# Altium schematic sheet control_module.SchDoc
size A4
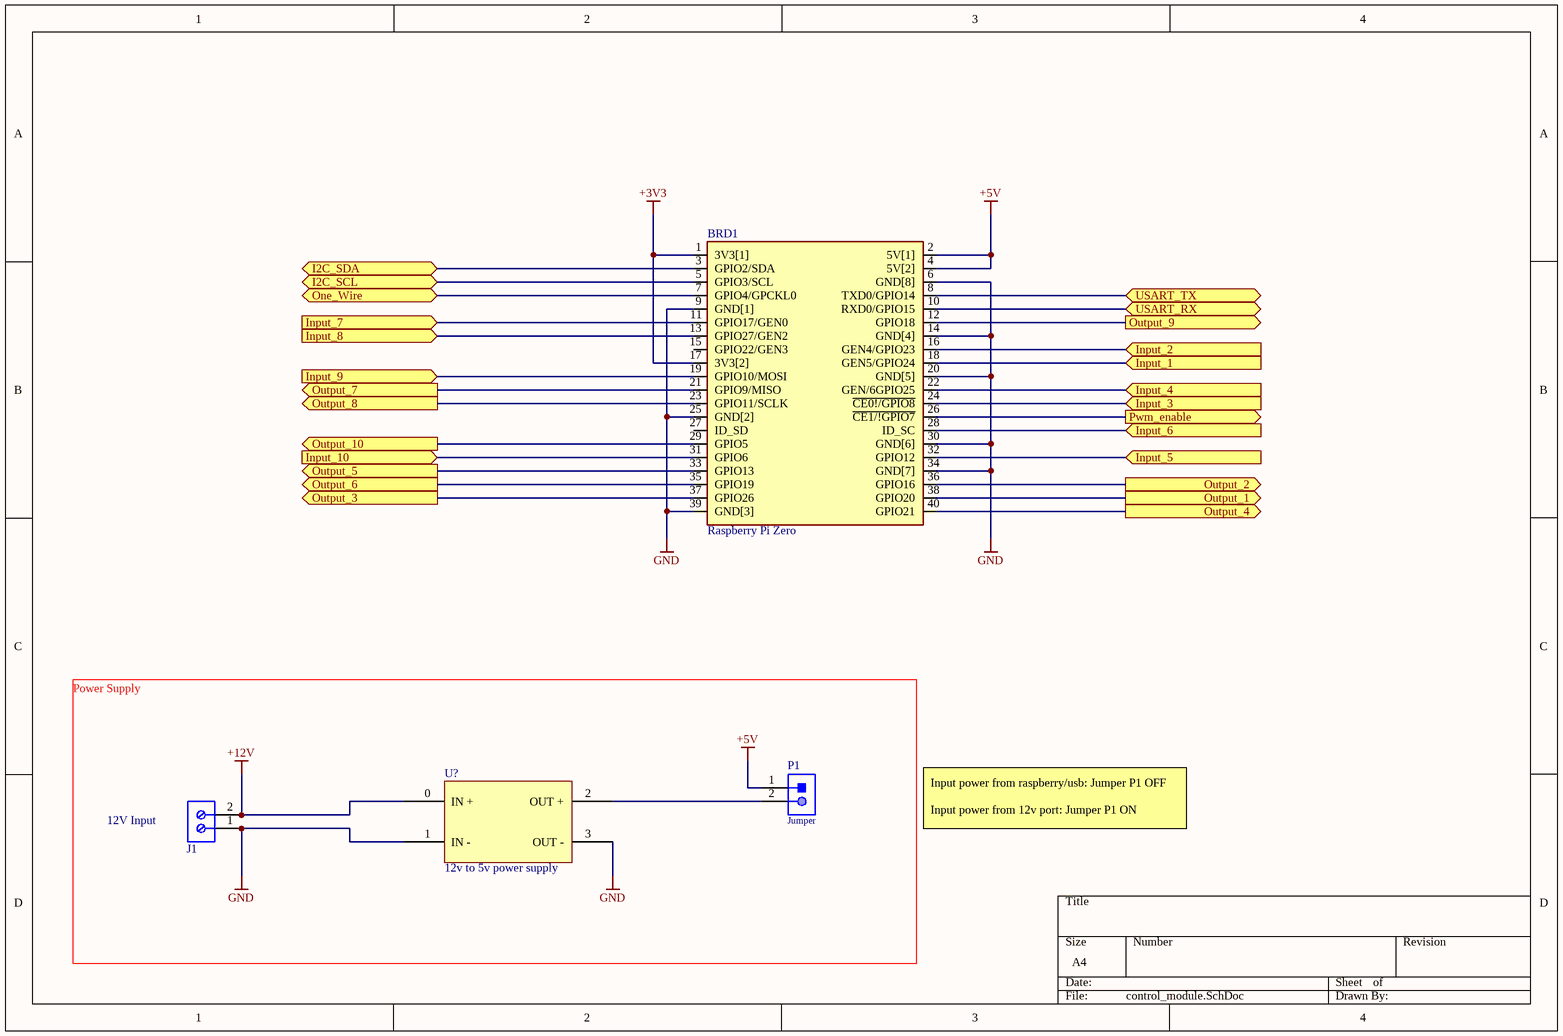
[diagram p0: control_module.SchDoc]

## Parts
BRD1  Raspberry Pi Zero  [RASPBERRY_PI_ZERO]
J1  282836-2  [TECO-282836-2_V]  (value not drawn)
P1  Jumper  [61300211121]
U?  12v to 5v power supply

## Ports
I2C_SCL (bidir), I2C_SDA (bidir), Input_1 (in), Input_2 (in), Input_3 (in), Input_4 (in), Input_5 (in), Input_6 (in), Input_7 (in), Input_8 (in), Input_9 (in), Input_10 (in), One_Wire (bidir), Output_1 (out), Output_2 (out), Output_3 (out), Output_4 (out), Output_5 (out), Output_6 (out), Output_7 (out), Output_8 (out), Output_9 (out), Output_10 (out), Pwm_enable (out), USART_RX (bidir), USART_TX (bidir)

## Nets
+3V3: BRD1.1(3V3[1]) BRD1.17(3V3[2])
+5V: BRD1.2(5V[1]) BRD1.4(5V[2]) P1.1
+12V: J1.2 U?.0(IN_+)
GND: BRD1.6(GND[8]) BRD1.9(GND[1]) BRD1.14(GND[4]) BRD1.20(GND[5]) BRD1.25(GND[2]) BRD1.30(GND[6]) BRD1.34(GND[7]) BRD1.39(GND[3]) J1.1 U?.1(IN_-) U?.3(OUT_-)
I2C_SCL: BRD1.5(GPIO3/SCL) ; port I2C_SCL
I2C_SDA: BRD1.3(GPIO2/SDA) ; port I2C_SDA
Input_1: BRD1.18(GEN5/GPIO24) ; port Input_1
Input_2: BRD1.16(GEN4/GPIO23) ; port Input_2
Input_3: BRD1.24(~{CE0!/GPIO8}) ; port Input_3
Input_4: BRD1.22(GEN/6GPIO25) ; port Input_4
Input_5: BRD1.32(GPIO12) ; port Input_5
Input_6: BRD1.28(ID_SC) ; port Input_6
Input_7: BRD1.11(GPIO17/GEN0) ; port Input_7
Input_8: BRD1.13(GPIO27/GEN2) ; port Input_8
Input_9: BRD1.19(GPIO10/MOSI) ; port Input_9
Input_10: BRD1.31(GPIO6) ; port Input_10
One_Wire: BRD1.7(GPIO4/GPCKL0) ; port One_Wire
Output_1: BRD1.38(GPIO20) ; port Output_1
Output_2: BRD1.36(GPIO16) ; port Output_2
Output_3: BRD1.37(GPIO26) ; port Output_3
Output_4: BRD1.40(GPIO21) ; port Output_4
Output_5: BRD1.33(GPIO13) ; port Output_5
Output_6: BRD1.35(GPIO19) ; port Output_6
Output_7: BRD1.21(GPIO9/MISO) ; port Output_7
Output_8: BRD1.23(GPIO11/SCLK) ; port Output_8
Output_9: BRD1.12(GPIO18) ; port Output_9
Output_10: BRD1.29(GPIO5) ; port Output_10
Pwm_enable: BRD1.26(~{CE1/!GPIO7}) ; port Pwm_enable
USART_RX: BRD1.10(RXD0/GPIO15) ; port USART_RX
USART_TX: BRD1.8(TXD0/GPIO14) ; port USART_TX
NetP1_2: P1.2 U?.2(OUT_+)

Not connected (* = marked no-connect by the designer): BRD1 15(GPIO22/GEN3) 27(ID_SD)

## Notes on the sheet
- (near J1) 12V Input
- Input power from raspberry/usb: Jumper P1 OFF
  Input power from 12v port: Jumper P1 ON
- Power Supply

## Library data of the parts
BRD1 = MCU_raspberryPi_zero: Raspberry Pi Zero with Header; MP: ADA3708; Availability: Unavailable; Package: None; MF: Raspberry Pi; Value: *; Price: None; SnapEDA_Link: https://www.snapeda.com/parts/ADA3708/Raspberry%20Pi/view-part/2770118/?ref=snap
J1 = CMP-1684-00017-1: Female Header, Pitch 5 mm, 1 x 2 Position, Height 10 mm, Tail Length 3.5 mm, Rohs, Bulk; Manufacturer: TE Connectivity; Wire Gauge: 16-30AWG; Product Training Modules: Wire-to-BoardEurostyleTerminalBlocks; Clamp Material - Plating: Brass-NickelPlated; Voltage: 300V; Mating Orientation: HorizontalwithBoard; Current: 13.5A; Pitch: 0.197"(5.00mm); Screw Thread: M3; 3D Model: 282836-2.pdf; Other Names: 5ULV-02B / A98076; Dynamic Catalog: BuchananSeries; Number of Levels: 1; Torque - Screw: 0.68Nm(6Lb-In); Featured Product: EurostyleTerminalBlockConnectors; Positions Per Level: 2; Wire Termination: Screw-RisingCageClamp; Datasheet URL: http://www.te.com.cn/commerce/DocumentDelivery/DDEController?Action=showdoc&DocId=Catalog+Section%7F1308389_EUROSTYLE_TERMINAL_BLOCKS%7F0607%7Fpdf%7FEnglish%7FENG_CS_1308389_EUROSTYLE_TERMINAL_BLOCKS_0607.pdf%7F282836-2; Color: Green; Family: TerminalBlocks-WiretoBoard; RoHS Information: 282836-2StatementofCompliance; Standard Package: 300; Contact Material - Plating: Brass-TinPlated; Manufacturer URL: http://www.te.com; Housing Material: Polyamide(PA66),Nylon6/6; Features: Interlocking(Side); Package Description: Female Header, Pitch 5 mm, 1 x 2 Position, Height 10 mm, Tail Length 3.5 mm; Mounting Type: ThroughHole; Package Reference: THD; Packaging: Bulk; Series: Buchanan; Category: Connectors,Interconnects; Screw Material - Plating: Brass-NickelPlated
P1 = CMP-1712-00002-4: THT Vertical Pin Header WR-PHD, Pitch 2.54 mm, Single Row, 2 pins; Manufacturer: Wurth Elektronik; Rated Current: 3A; Gender: Male; Withstanding Voltage: 500VAC; Working Voltage: 250VAC; Pitch: 2.54mm; Contact Resistance: 20mOhm; Pin Number: 2; Mounting Technology: THT; Orientation: Vertical; Operating Temperature: -40to105degC; Packaging: Bag; Publisher: WurthElektronik; Datasheet URL: https://katalog.we-online.de/em/datasheet/6130xx11121.pdf; Manufacturer URL: http://www.we-online.de; Row Number: Single; Package Reference: 61300211121; Part Number: 61300211121
U? = power_supply_5v: 12V TO 5V buck converter